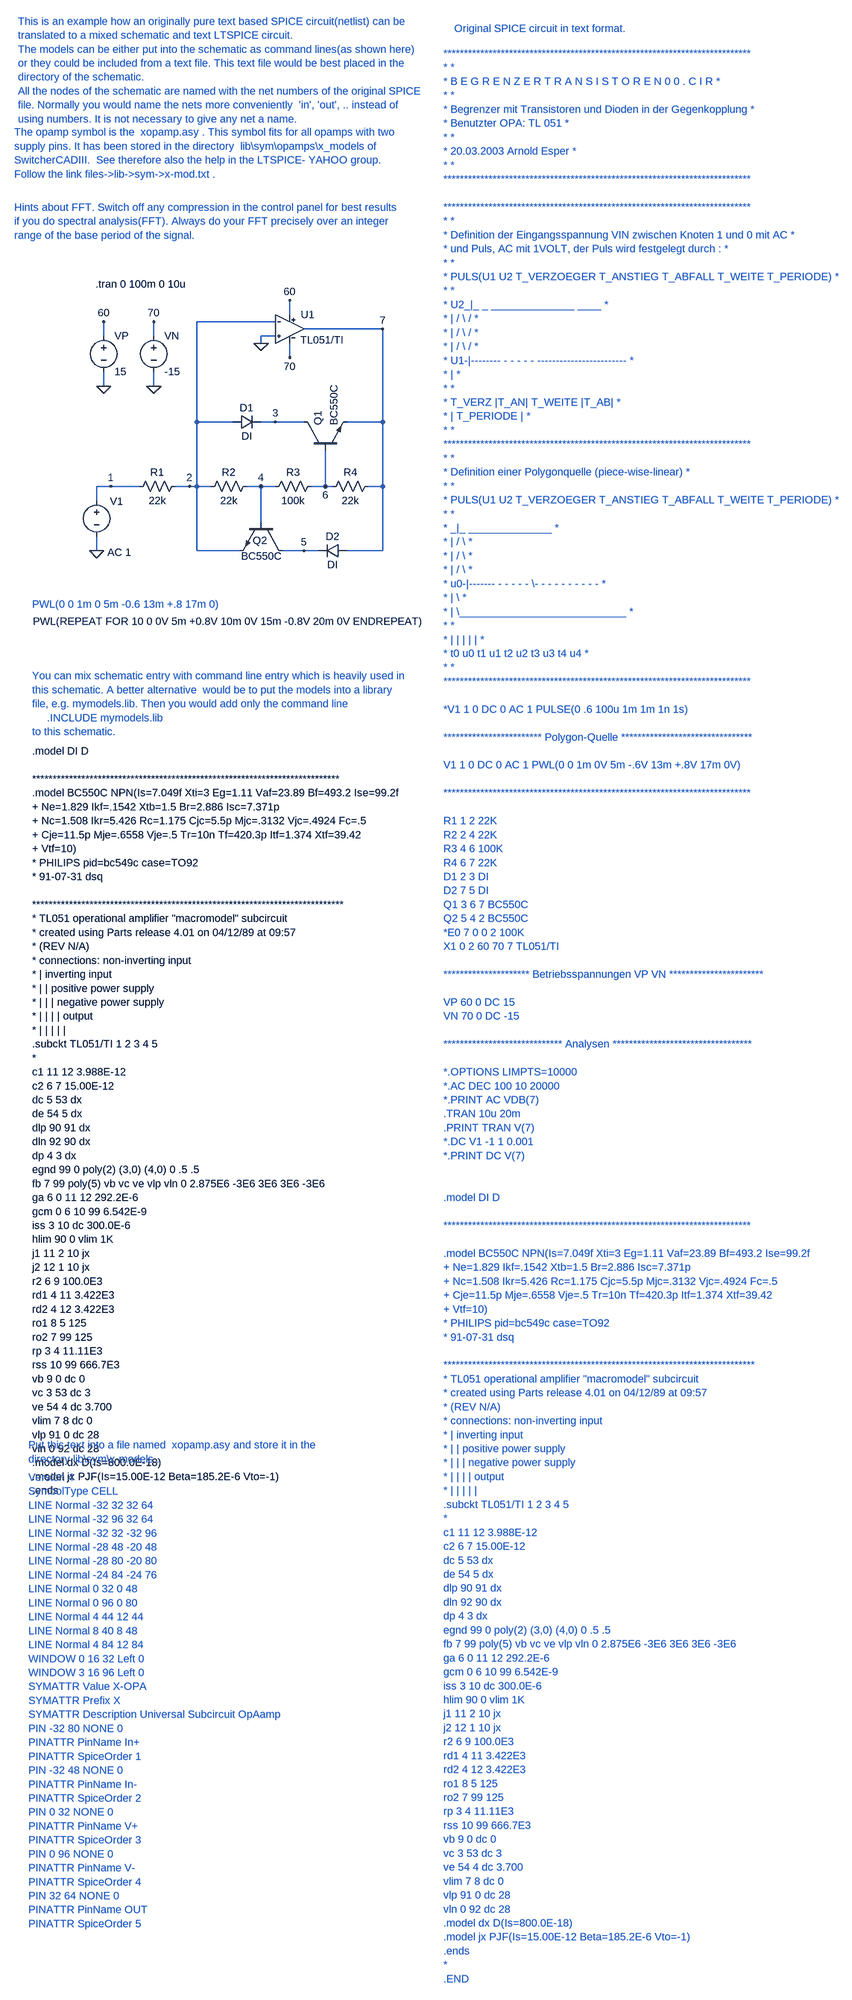
[diagram p0: schematic Limiter1.asc]
Limiter1.asc, the LTspice schematic file:
Version 4
SHEET 1 2176 3768
WIRE 704 -32 736 -32
WIRE 560 -32 592 -32
WIRE 592 -32 592 48
WIRE 592 -32 624 -32
WIRE 320 -32 256 -32
WIRE 224 -32 224 0
WIRE 400 -32 432 -32
WIRE 256 -32 224 -32
WIRE 736 -32 752 -32
WIRE 864 -32 832 -32
WIRE 864 112 864 -32
WIRE 448 -32 448 112
WIRE 656 -416 656 -448
WIRE 656 -352 656 -320
WIRE 688 -384 864 -384
WIRE 864 -384 864 -176
WIRE 624 -400 448 -400
WIRE 448 -400 448 -176
WIRE 448 -32 480 -32
WIRE 624 -368 592 -368
WIRE 592 -368 592 -352
WIRE 224 80 224 112
WIRE 784 -176 864 -176
WIRE 864 -176 864 -32
WIRE 688 -176 624 -176
WIRE 528 -176 448 -176
WIRE 448 -176 448 -32
WIRE 736 -32 736 -112
WIRE 624 -176 592 -176
WIRE 864 112 784 112
WIRE 720 112 688 112
WIRE 544 112 448 112
WIRE 688 112 640 112
WIRE 352 -368 352 -400
WIRE 240 -368 240 -400
WIRE 240 -288 240 -256
WIRE 352 -288 352 -256
WIRE 432 -32 448 -32
FLAG 256 -32 1
FLAG 432 -32 2
FLAG 592 -32 4
FLAG 736 -32 6
FLAG 864 -384 7
FLAG 624 -176 3
FLAG 688 112 5
FLAG 656 -448 60
FLAG 656 -320 70
FLAG 592 -352 0
FLAG 224 112 0
FLAG 240 -256 0
FLAG 352 -256 0
FLAG 240 -400 60
FLAG 352 -400 70
SYMBOL voltage 224 -16 R0
WINDOW 123 24 132 Left 0
WINDOW 39 0 0 Left 0
WINDOW 0 30 18 Left 0
WINDOW 3 -142 286 Left 0
SYMATTR Value2 AC 1
SYMATTR InstName V1
SYMATTR Value PWL(REPEAT FOR 10 0 0V 5m +0.8V 10m 0V 15m -0.8V 20m 0V ENDREPEAT)
SYMBOL res 304 -16 R270
WINDOW 0 32 56 VTop 0
WINDOW 3 0 56 VBottom 0
SYMATTR InstName R1
SYMATTR Value 22k
SYMBOL res 464 -16 R270
WINDOW 0 32 56 VTop 0
WINDOW 3 0 56 VBottom 0
SYMATTR InstName R2
SYMATTR Value 22k
SYMBOL res 608 -16 R270
WINDOW 0 32 56 VTop 0
WINDOW 3 0 56 VBottom 0
SYMATTR InstName R3
SYMATTR Value 100k
SYMBOL res 736 -16 R270
WINDOW 0 32 56 VTop 0
WINDOW 3 0 56 VBottom 0
SYMATTR InstName R4
SYMATTR Value 22k
SYMBOL diode 528 -160 R270
WINDOW 0 32 32 VTop 0
WINDOW 3 0 32 VBottom 0
SYMATTR InstName D1
SYMATTR Value DI
SYMBOL diode 784 96 R90
WINDOW 0 0 32 VBottom 0
WINDOW 3 32 32 VTop 0
SYMATTR InstName D2
SYMATTR Value DI
SYMBOL npn 688 -112 R270
SYMATTR InstName Q1
SYMATTR Value BC550C
SYMBOL npn 640 48 R90
WINDOW 0 41 34 VRight 0
WINDOW 3 76 2 VRight 0
SYMATTR InstName Q2
SYMATTR Value BC550C
SYMBOL xopamp 656 -448 R0
SYMATTR InstName U1
SYMATTR Value TL051/TI
SYMATTR SpiceModel TL051/TI
SYMBOL voltage 240 -384 R0
SYMATTR InstName VP
SYMATTR Value 15
SYMBOL voltage 352 -384 R0
SYMATTR InstName VN
SYMATTR Value -15
TEXT 222 -484 Left 0 !.tran 0 100m 0 10u
TEXT 80 560 Left 0 !.model DI D\n \n***************************************************************************\n.model BC550C NPN(Is=7.049f Xti=3 Eg=1.11 Vaf=23.89 Bf=493.2 Ise=99.2f\n+ Ne=1.829 Ikf=.1542 Xtb=1.5 Br=2.886 Isc=7.371p\n+ Nc=1.508 Ikr=5.426 Rc=1.175 Cjc=5.5p Mjc=.3132 Vjc=.4924 Fc=.5\n+ Cje=11.5p Mje=.6558 Vje=.5 Tr=10n Tf=420.3p Itf=1.374 Xtf=39.42\n+ Vtf=10)\n* PHILIPS pid=bc549c case=TO92\n* 91-07-31 dsq\n \n****************************************************************************\n* TL051 operational amplifier "macromodel" subcircuit\n* created using Parts release 4.01 on 04/12/89 at 09:57\n* (REV N/A)\n* connections: non-inverting input\n* | inverting input\n* | | positive power supply\n* | | | negative power supply\n* | | | | output\n* | | | | |\n.subckt TL051/TI 1 2 3 4 5\n*\nc1 11 12 3.988E-12\nc2 6 7 15.00E-12\ndc 5 53 dx\nde 54 5 dx\ndlp 90 91 dx\ndln 92 90 dx\ndp 4 3 dx\negnd 99 0 poly(2) (3,0) (4,0) 0 .5 .5\nfb 7 99 poly(5) vb vc ve vlp vln 0 2.875E6 -3E6 3E6 3E6 -3E6\nga 6 0 11 12 292.2E-6\ngcm 0 6 10 99 6.542E-9\niss 3 10 dc 300.0E-6\nhlim 90 0 vlim 1K\nj1 11 2 10 jx\nj2 12 1 10 jx\nr2 6 9 100.0E3\nrd1 4 11 3.422E3\nrd2 4 12 3.422E3\nro1 8 5 125\nro2 7 99 125\nrp 3 4 11.11E3\nrss 10 99 666.7E3\nvb 9 0 dc 0\nvc 3 53 dc 3\nve 54 4 dc 3.700\nvlim 7 8 dc 0\nvlp 91 0 dc 28\nvln 0 92 dc 28\n.model dx D(Is=800.0E-18)\n.model jx PJF(Is=15.00E-12 Beta=185.2E-6 Vto=-1)\n.ends
TEXT 80 232 Left 0 ;PWL(0 0 1m 0 5m -0.6 13m +.8 17m 0)
TEXT 40 -656 Left 0 ;Hints about FFT. Switch off any compression in the control panel for best results\nif you do spectral analysis(FFT). Always do your FFT precisely over an integer\nrange of the base period of the signal.
TEXT 80 392 Left 0 ;You can mix schematic entry with command line entry which is heavily used in\nthis schematic. A better alternative  would be to put the models into a library\nfile, e.g. mymodels.lib. Then you would add only the command line  \n     .INCLUDE mymodels.lib\nto this schematic.
TEXT 40 -824 Left 0 ;The opamp symbol is the  xopamp.asy . This symbol fits for all opamps with two\nsupply pins. It has been stored in the directory  lib\\sym\\opamps\\x_models of \nSwitcherCADIII.  See therefore also the help in the LTSPICE- YAHOO group. \nFollow the link files->lib->sym->x-mod.txt .
TEXT 1000 -1000 Left 0 ;***************************************************************************\n* *\n* B E G R E N Z E R T R A N S I S T O R E N 0 0 . C I R *\n* *\n* Begrenzer mit Transistoren und Dioden in der Gegenkopplung *\n* Benutzter OPA: TL 051 *\n* *\n* 20.03.2003 Arnold Esper *\n* *\n***************************************************************************\n \n***************************************************************************\n* *\n* Definition der Eingangsspannung VIN zwischen Knoten 1 und 0 mit AC *\n* und Puls, AC mit 1VOLT, der Puls wird festgelegt durch : *\n* *\n* PULS(U1 U2 T_VERZOEGER T_ANSTIEG T_ABFALL T_WEITE T_PERIODE) *\n* *\n* U2_|_ _ ______________ ____ *\n* | / \\ / *\n* | / \\ / *\n* | / \\ / *\n* U1-|-------- - - - - - ------------------------ *\n* | *\n* *\n* T_VERZ |T_AN| T_WEITE |T_AB| *\n* | T_PERIODE | *\n* *\n***************************************************************************\n* *\n* Definition einer Polygonquelle (piece-wise-linear) *\n* *\n* PULS(U1 U2 T_VERZOEGER T_ANSTIEG T_ABFALL T_WEITE T_PERIODE) *\n* *\n* _|_ ______________ *\n* | / \\ *\n* | / \\ *\n* | / \\ *\n* u0-|------- - - - - - \\- - - - - - - - - - *\n* | \\ *\n* | \\____________________________ *\n* *\n* | | | | | *\n* t0 u0 t1 u1 t2 u2 t3 u3 t4 u4 *\n* *\n***************************************************************************\n \n*V1 1 0 DC 0 AC 1 PULSE(0 .6 100u 1m 1m 1n 1s)\n \n************************ Polygon-Quelle ********************************\n \nV1 1 0 DC 0 AC 1 PWL(0 0 1m 0V 5m -.6V 13m +.8V 17m 0V)\n \n***************************************************************************\n \nR1 1 2 22K\nR2 2 4 22K\nR3 4 6 100K\nR4 6 7 22K\nD1 2 3 DI\nD2 7 5 DI\nQ1 3 6 7 BC550C\nQ2 5 4 2 BC550C\n*E0 7 0 0 2 100K\nX1 0 2 60 70 7 TL051/TI\n \n********************* Betriebsspannungen VP VN ***********************\n \nVP 60 0 DC 15\nVN 70 0 DC -15\n \n***************************** Analysen **********************************\n \n*.OPTIONS LIMPTS=10000\n*.AC DEC 100 10 20000\n*.PRINT AC VDB(7)\n.TRAN 10u 20m\n.PRINT TRAN V(7)\n*.DC V1 -1 1 0.001\n*.PRINT DC V(7)\n \n \n.model DI D\n \n***************************************************************************\n \n.model BC550C NPN(Is=7.049f Xti=3 Eg=1.11 Vaf=23.89 Bf=493.2 Ise=99.2f\n+ Ne=1.829 Ikf=.1542 Xtb=1.5 Br=2.886 Isc=7.371p\n+ Nc=1.508 Ikr=5.426 Rc=1.175 Cjc=5.5p Mjc=.3132 Vjc=.4924 Fc=.5\n+ Cje=11.5p Mje=.6558 Vje=.5 Tr=10n Tf=420.3p Itf=1.374 Xtf=39.42\n+ Vtf=10)\n* PHILIPS pid=bc549c case=TO92\n* 91-07-31 dsq\n \n****************************************************************************\n* TL051 operational amplifier "macromodel" subcircuit\n* created using Parts release 4.01 on 04/12/89 at 09:57\n* (REV N/A)\n* connections: non-inverting input\n* | inverting input\n* | | positive power supply\n* | | | negative power supply\n* | | | | output\n* | | | | |\n.subckt TL051/TI 1 2 3 4 5\n*\nc1 11 12 3.988E-12\nc2 6 7 15.00E-12\ndc 5 53 dx\nde 54 5 dx\ndlp 90 91 dx\ndln 92 90 dx\ndp 4 3 dx\negnd 99 0 poly(2) (3,0) (4,0) 0 .5 .5\nfb 7 99 poly(5) vb vc ve vlp vln 0 2.875E6 -3E6 3E6 3E6 -3E6\nga 6 0 11 12 292.2E-6\ngcm 0 6 10 99 6.542E-9\niss 3 10 dc 300.0E-6\nhlim 90 0 vlim 1K\nj1 11 2 10 jx\nj2 12 1 10 jx\nr2 6 9 100.0E3\nrd1 4 11 3.422E3\nrd2 4 12 3.422E3\nro1 8 5 125\nro2 7 99 125\nrp 3 4 11.11E3\nrss 10 99 666.7E3\nvb 9 0 dc 0\nvc 3 53 dc 3\nve 54 4 dc 3.700\nvlim 7 8 dc 0\nvlp 91 0 dc 28\nvln 0 92 dc 28\n.model dx D(Is=800.0E-18)\n.model jx PJF(Is=15.00E-12 Beta=185.2E-6 Vto=-1)\n.ends\n*\n.END
TEXT 1024 -1056 Left 0 ;Original SPICE circuit in text format.
TEXT 48 -1072 Left 0 ;This is an example how an originally pure text based SPICE circuit(netlist) can be \ntranslated to a mixed schematic and text LTSPICE circuit. \nThe models can be either put into the schematic as command lines(as shown here)\nor they could be included from a text file. This text file would be best placed in the\ndirectory of the schematic.\nAll the nodes of the schematic are named with the net numbers of the original SPICE\nfile. Normally you would name the nets more conveniently  'in', 'out', .. instead of\nusing numbers. It is not necessary to give any net a name.
TEXT 72 2184 Left 0 ;Version 4\nSymbolType CELL\nLINE Normal -32 32 32 64\nLINE Normal -32 96 32 64\nLINE Normal -32 32 -32 96\nLINE Normal -28 48 -20 48\nLINE Normal -28 80 -20 80\nLINE Normal -24 84 -24 76\nLINE Normal 0 32 0 48\nLINE Normal 0 96 0 80\nLINE Normal 4 44 12 44\nLINE Normal 8 40 8 48\nLINE Normal 4 84 12 84\nWINDOW 0 16 32 Left 0\nWINDOW 3 16 96 Left 0\nSYMATTR Value X-OPA\nSYMATTR Prefix X\nSYMATTR Description Universal Subcircuit OpAamp\nPIN -32 80 NONE 0\nPINATTR PinName In+\nPINATTR SpiceOrder 1\nPIN -32 48 NONE 0\nPINATTR PinName In-\nPINATTR SpiceOrder 2\nPIN 0 32 NONE 0\nPINATTR PinName V+\nPINATTR SpiceOrder 3\nPIN 0 96 NONE 0\nPINATTR PinName V-\nPINATTR SpiceOrder 4\nPIN 32 64 NONE 0\nPINATTR PinName OUT\nPINATTR SpiceOrder 5
TEXT 72 2112 Left 0 ;Put this text into a file named  xopamp.asy and store it in the \ndirectory lib\\sym\\x-models .

The netlist it stands for:
* Limiter1.asc
V1 1 0 PWL(REPEAT FOR 10 0 0V 5m +0.8V 10m 0V 15m -0.8V 20m 0V ENDREPEAT) AC 1
R1 1 2 22k
R2 2 4 22k
R3 4 6 100k
R4 6 7 22k
D1 2 3 DI
D2 7 5 DI
Q1 3 6 7 0 BC550C
Q2 5 4 2 0 BC550C
XU1 0 2 60 70 7 TL051/TI TL051/TI  ; pins In+ In- V+ V- OUT
VP 60 0 15
VN 70 0 -15
.model D D
.lib standard.dio
.model NPN NPN
.model PNP PNP
.lib standard.bjt
.tran 0 100m 0 10u
.model DI D
***************************************************************************
.model BC550C NPN(Is=7.049f Xti=3 Eg=1.11 Vaf=23.89 Bf=493.2 Ise=99.2f
+ Ne=1.829 Ikf=.1542 Xtb=1.5 Br=2.886 Isc=7.371p
+ Nc=1.508 Ikr=5.426 Rc=1.175 Cjc=5.5p Mjc=.3132 Vjc=.4924 Fc=.5
+ Cje=11.5p Mje=.6558 Vje=.5 Tr=10n Tf=420.3p Itf=1.374 Xtf=39.42
+ Vtf=10)
* PHILIPS pid=bc549c case=TO92
* 91-07-31 dsq
****************************************************************************
* TL051 operational amplifier "macromodel" subcircuit
* created using Parts release 4.01 on 04/12/89 at 09:57
* (REV N/A)
* connections: non-inverting input
* | inverting input
* | | positive power supply
* | | | negative power supply
* | | | | output
* | | | | |
.subckt TL051/TI 1 2 3 4 5
*
c1 11 12 3.988E-12
c2 6 7 15.00E-12
dc 5 53 dx
de 54 5 dx
dlp 90 91 dx
dln 92 90 dx
dp 4 3 dx
egnd 99 0 poly(2) (3,0) (4,0) 0 .5 .5
fb 7 99 poly(5) vb vc ve vlp vln 0 2.875E6 -3E6 3E6 3E6 -3E6
ga 6 0 11 12 292.2E-6
gcm 0 6 10 99 6.542E-9
iss 3 10 dc 300.0E-6
hlim 90 0 vlim 1K
j1 11 2 10 jx
j2 12 1 10 jx
r2 6 9 100.0E3
rd1 4 11 3.422E3
rd2 4 12 3.422E3
ro1 8 5 125
ro2 7 99 125
rp 3 4 11.11E3
rss 10 99 666.7E3
vb 9 0 dc 0
vc 3 53 dc 3
ve 54 4 dc 3.700
vlim 7 8 dc 0
vlp 91 0 dc 28
vln 0 92 dc 28
.model dx D(Is=800.0E-18)
.model jx PJF(Is=15.00E-12 Beta=185.2E-6 Vto=-1)
.ends
* PWL(0 0 1m 0 5m -0.6 13m +.8 17m 0)
* Hints about FFT. Switch off any compression in the control panel for best results
* if you do spectral analysis(FFT). Always do your FFT precisely over an integer
* range of the base period of the signal.
* You can mix schematic entry with command line entry which is heavily used in
* this schematic. A better alternative  would be to put the models into a library
* file, e.g. mymodels.lib. Then you would add only the command line
*      .INCLUDE mymodels.lib
* to this schematic.
* The opamp symbol is the  xopamp.asy . This symbol fits for all opamps with two
* supply pins. It has been stored in the directory  lib\sym\opamps\x_models of
* SwitcherCADIII.  See therefore also the help in the LTSPICE- YAHOO group.
* Follow the link files->lib->sym->x-mod.txt .
* ***************************************************************************
* * *
* * B E G R E N Z E R T R A N S I S T O R E N 0 0 . C I R *
* * *
* * Begrenzer mit Transistoren und Dioden in der Gegenkopplung *
* * Benutzter OPA: TL 051 *
* * *
* * 20.03.2003 Arnold Esper *
* * *
* ***************************************************************************
* ***************************************************************************
* * *
* * Definition der Eingangsspannung VIN zwischen Knoten 1 und 0 mit AC *
* * und Puls, AC mit 1VOLT, der Puls wird festgelegt durch : *
* * *
* * PULS(U1 U2 T_VERZOEGER T_ANSTIEG T_ABFALL T_WEITE T_PERIODE) *
* * *
* * U2_|_ _ ______________ ____ *
* * | / \ / *
* * | / \ / *
* * | / \ / *
* * U1-|-------- - - - - - ------------------------ *
* * | *
* * *
* * T_VERZ |T_AN| T_WEITE |T_AB| *
* * | T_PERIODE | *
* * *
* ***************************************************************************
* * *
* * Definition einer Polygonquelle (piece-wise-linear) *
* * *
* * PULS(U1 U2 T_VERZOEGER T_ANSTIEG T_ABFALL T_WEITE T_PERIODE) *
* * *
* * _|_ ______________ *
* * | / \ *
* * | / \ *
* * | / \ *
* * u0-|------- - - - - - \- - - - - - - - - - *
* * | \ *
* * | \____________________________ *
* * *
* * | | | | | *
* * t0 u0 t1 u1 t2 u2 t3 u3 t4 u4 *
* * *
* ***************************************************************************
* *V1 1 0 DC 0 AC 1 PULSE(0 .6 100u 1m 1m 1n 1s)
* ************************ Polygon-Quelle ********************************
* V1 1 0 DC 0 AC 1 PWL(0 0 1m 0V 5m -.6V 13m +.8V 17m 0V)
* ***************************************************************************
* R1 1 2 22K
* R2 2 4 22K
* R3 4 6 100K
* R4 6 7 22K
* D1 2 3 DI
* D2 7 5 DI
* Q1 3 6 7 BC550C
* Q2 5 4 2 BC550C
* *E0 7 0 0 2 100K
* X1 0 2 60 70 7 TL051/TI
* ********************* Betriebsspannungen VP VN ***********************
* VP 60 0 DC 15
* VN 70 0 DC -15
* ***************************** Analysen **********************************
* *.OPTIONS LIMPTS=10000
* *.AC DEC 100 10 20000
* *.PRINT AC VDB(7)
* .TRAN 10u 20m
* .PRINT TRAN V(7)
* *.DC V1 -1 1 0.001
* *.PRINT DC V(7)
* .model DI D
* ***************************************************************************
* .model BC550C NPN(Is=7.049f Xti=3 Eg=1.11 Vaf=23.89 Bf=493.2 Ise=99.2f
* + Ne=1.829 Ikf=.1542 Xtb=1.5 Br=2.886 Isc=7.371p
* + Nc=1.508 Ikr=5.426 Rc=1.175 Cjc=5.5p Mjc=.3132 Vjc=.4924 Fc=.5
* + Cje=11.5p Mje=.6558 Vje=.5 Tr=10n Tf=420.3p Itf=1.374 Xtf=39.42
* + Vtf=10)
* * PHILIPS pid=bc549c case=TO92
* * 91-07-31 dsq
* ****************************************************************************
* * TL051 operational amplifier "macromodel" subcircuit
* * created using Parts release 4.01 on 04/12/89 at 09:57
* * (REV N/A)
* * connections: non-inverting input
* * | inverting input
* * | | positive power supply
* * | | | negative power supply
* * | | | | output
* * | | | | |
* .subckt TL051/TI 1 2 3 4 5
* *
* c1 11 12 3.988E-12
* c2 6 7 15.00E-12
* dc 5 53 dx
* de 54 5 dx
* dlp 90 91 dx
* dln 92 90 dx
* dp 4 3 dx
* egnd 99 0 poly(2) (3,0) (4,0) 0 .5 .5
* fb 7 99 poly(5) vb vc ve vlp vln 0 2.875E6 -3E6 3E6 3E6 -3E6
* ga 6 0 11 12 292.2E-6
* gcm 0 6 10 99 6.542E-9
* iss 3 10 dc 300.0E-6
* hlim 90 0 vlim 1K
* j1 11 2 10 jx
* j2 12 1 10 jx
* r2 6 9 100.0E3
* rd1 4 11 3.422E3
* rd2 4 12 3.422E3
* ro1 8 5 125
* ro2 7 99 125
* rp 3 4 11.11E3
* rss 10 99 666.7E3
* vb 9 0 dc 0
* vc 3 53 dc 3
* ve 54 4 dc 3.700
* vlim 7 8 dc 0
* vlp 91 0 dc 28
* vln 0 92 dc 28
* .model dx D(Is=800.0E-18)
* .model jx PJF(Is=15.00E-12 Beta=185.2E-6 Vto=-1)
* .ends
* *
* .END
* Original SPICE circuit in text format.
* This is an example how an originally pure text based SPICE circuit(netlist) can be
* translated to a mixed schematic and text LTSPICE circuit.
* The models can be either put into the schematic as command lines(as shown here)
* or they could be included from a text file. This text file would be best placed in the
* directory of the schematic.
* All the nodes of the schematic are named with the net numbers of the original SPICE
* file. Normally you would name the nets more conveniently  'in', 'out', .. instead of
* using numbers. It is not necessary to give any net a name.
* Version 4
* SymbolType CELL
* LINE Normal -32 32 32 64
* LINE Normal -32 96 32 64
* LINE Normal -32 32 -32 96
* LINE Normal -28 48 -20 48
* LINE Normal -28 80 -20 80
* LINE Normal -24 84 -24 76
* LINE Normal 0 32 0 48
* LINE Normal 0 96 0 80
* LINE Normal 4 44 12 44
* LINE Normal 8 40 8 48
* LINE Normal 4 84 12 84
* WINDOW 0 16 32 Left 0
* WINDOW 3 16 96 Left 0
* SYMATTR Value X-OPA
* SYMATTR Prefix X
* SYMATTR Description Universal Subcircuit OpAamp
* PIN -32 80 NONE 0
* PINATTR PinName In+
* PINATTR SpiceOrder 1
* PIN -32 48 NONE 0
* PINATTR PinName In-
* PINATTR SpiceOrder 2
* PIN 0 32 NONE 0
* PINATTR PinName V+
* PINATTR SpiceOrder 3
* PIN 0 96 NONE 0
* PINATTR PinName V-
* PINATTR SpiceOrder 4
* PIN 32 64 NONE 0
* PINATTR PinName OUT
* PINATTR SpiceOrder 5
* Put this text into a file named  xopamp.asy and store it in the
* directory lib\sym\x-models .
.backanno
.end